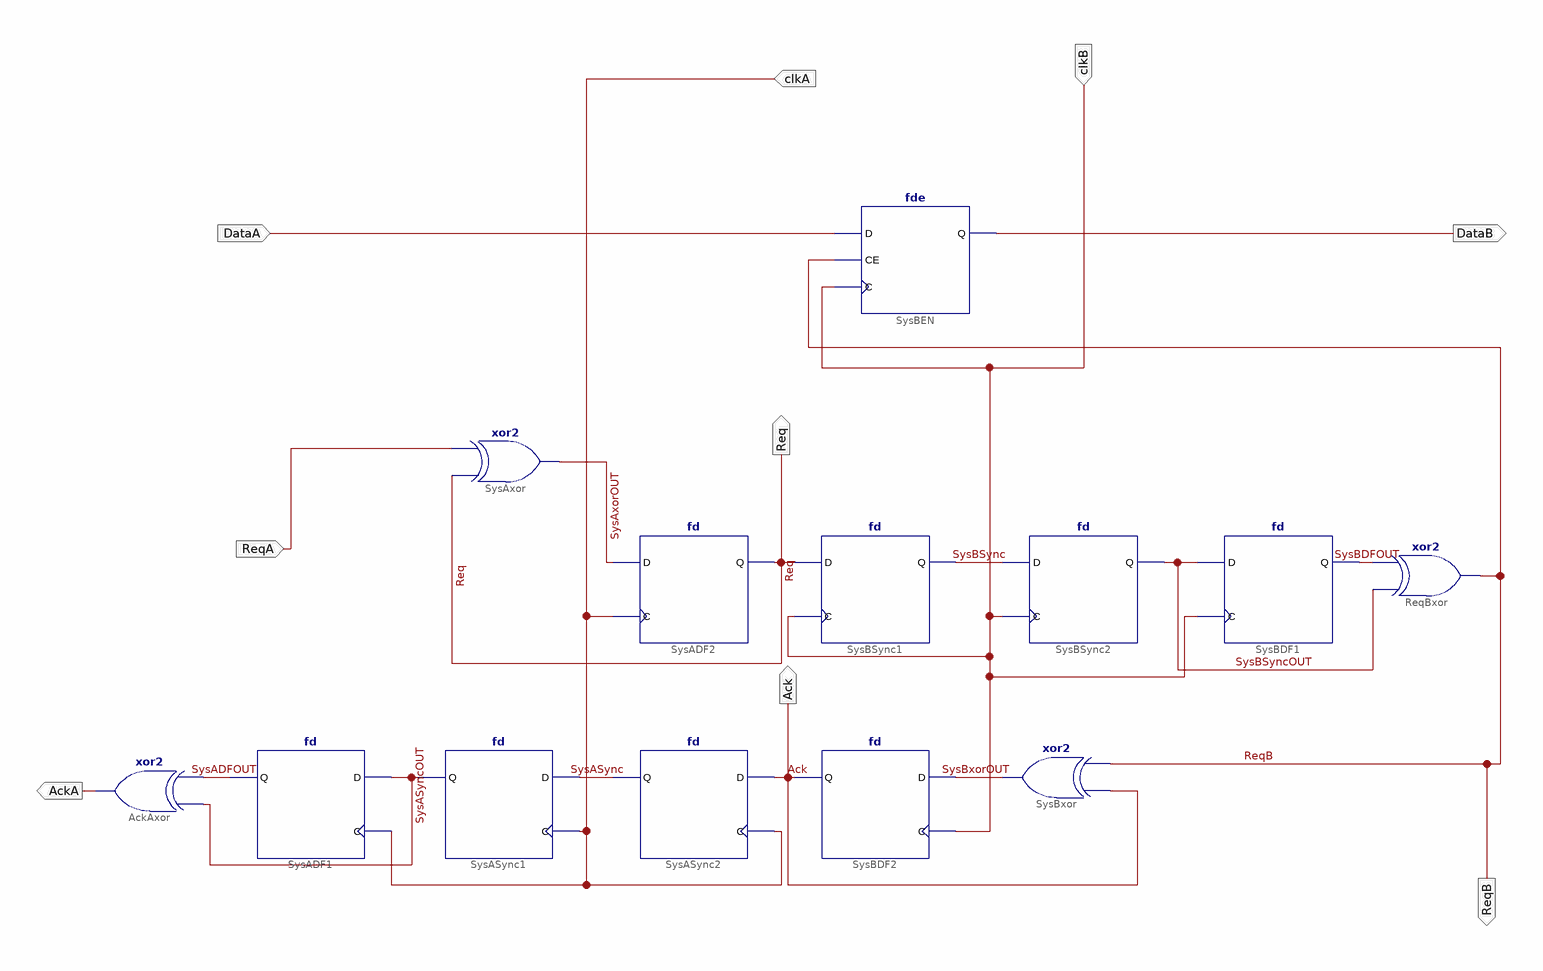
[diagram p0: schematic sheet 1]
// Xilinx ISE schematic TwoPhaseHandshakeSchem.sch (spartan3) as structural Verilog: 13 symbols, 9 ports
module TwoPhaseHandshakeSchem (
  input  clkA,
  input  DataA,
  input  ReqA,
  input  clkB,
  output Req,
  output Ack,
  output DataB,
  output AckA,
  output ReqB
);

  wire SysADFOUT, SysASync, SysASyncOUT, SysAxorOUT, SysBDFOUT, SysBSync, SysBSyncOUT, SysBxorOUT;

  fde SysBEN (.C(clkB), .CE(ReqB), .D(DataA), .Q(DataB));
  fd SysASync2 (.C(clkA), .D(Ack), .Q(SysASync));
  fd SysASync1 (.C(clkA), .D(SysASync), .Q(SysASyncOUT));
  fd SysADF2 (.C(clkA), .D(SysAxorOUT), .Q(Req));
  fd SysADF1 (.C(clkA), .D(SysASyncOUT), .Q(SysADFOUT));
  xor AckAxor (AckA, SysASyncOUT, SysADFOUT);
  xor SysAxor (SysAxorOUT, Req, ReqA);
  xor ReqBxor (ReqB, SysBSyncOUT, SysBDFOUT);
  fd SysBDF2 (.C(clkB), .D(SysBxorOUT), .Q(Ack));
  fd SysBSync1 (.C(clkB), .D(Req), .Q(SysBSync));
  fd SysBSync2 (.C(clkB), .D(SysBSync), .Q(SysBSyncOUT));
  fd SysBDF1 (.C(clkB), .D(SysBSyncOUT), .Q(SysBDFOUT));
  xor SysBxor (SysBxorOUT, Ack, ReqB);
endmodule
